# EAGLE design motorfilter (EAGLE 9.5.2)
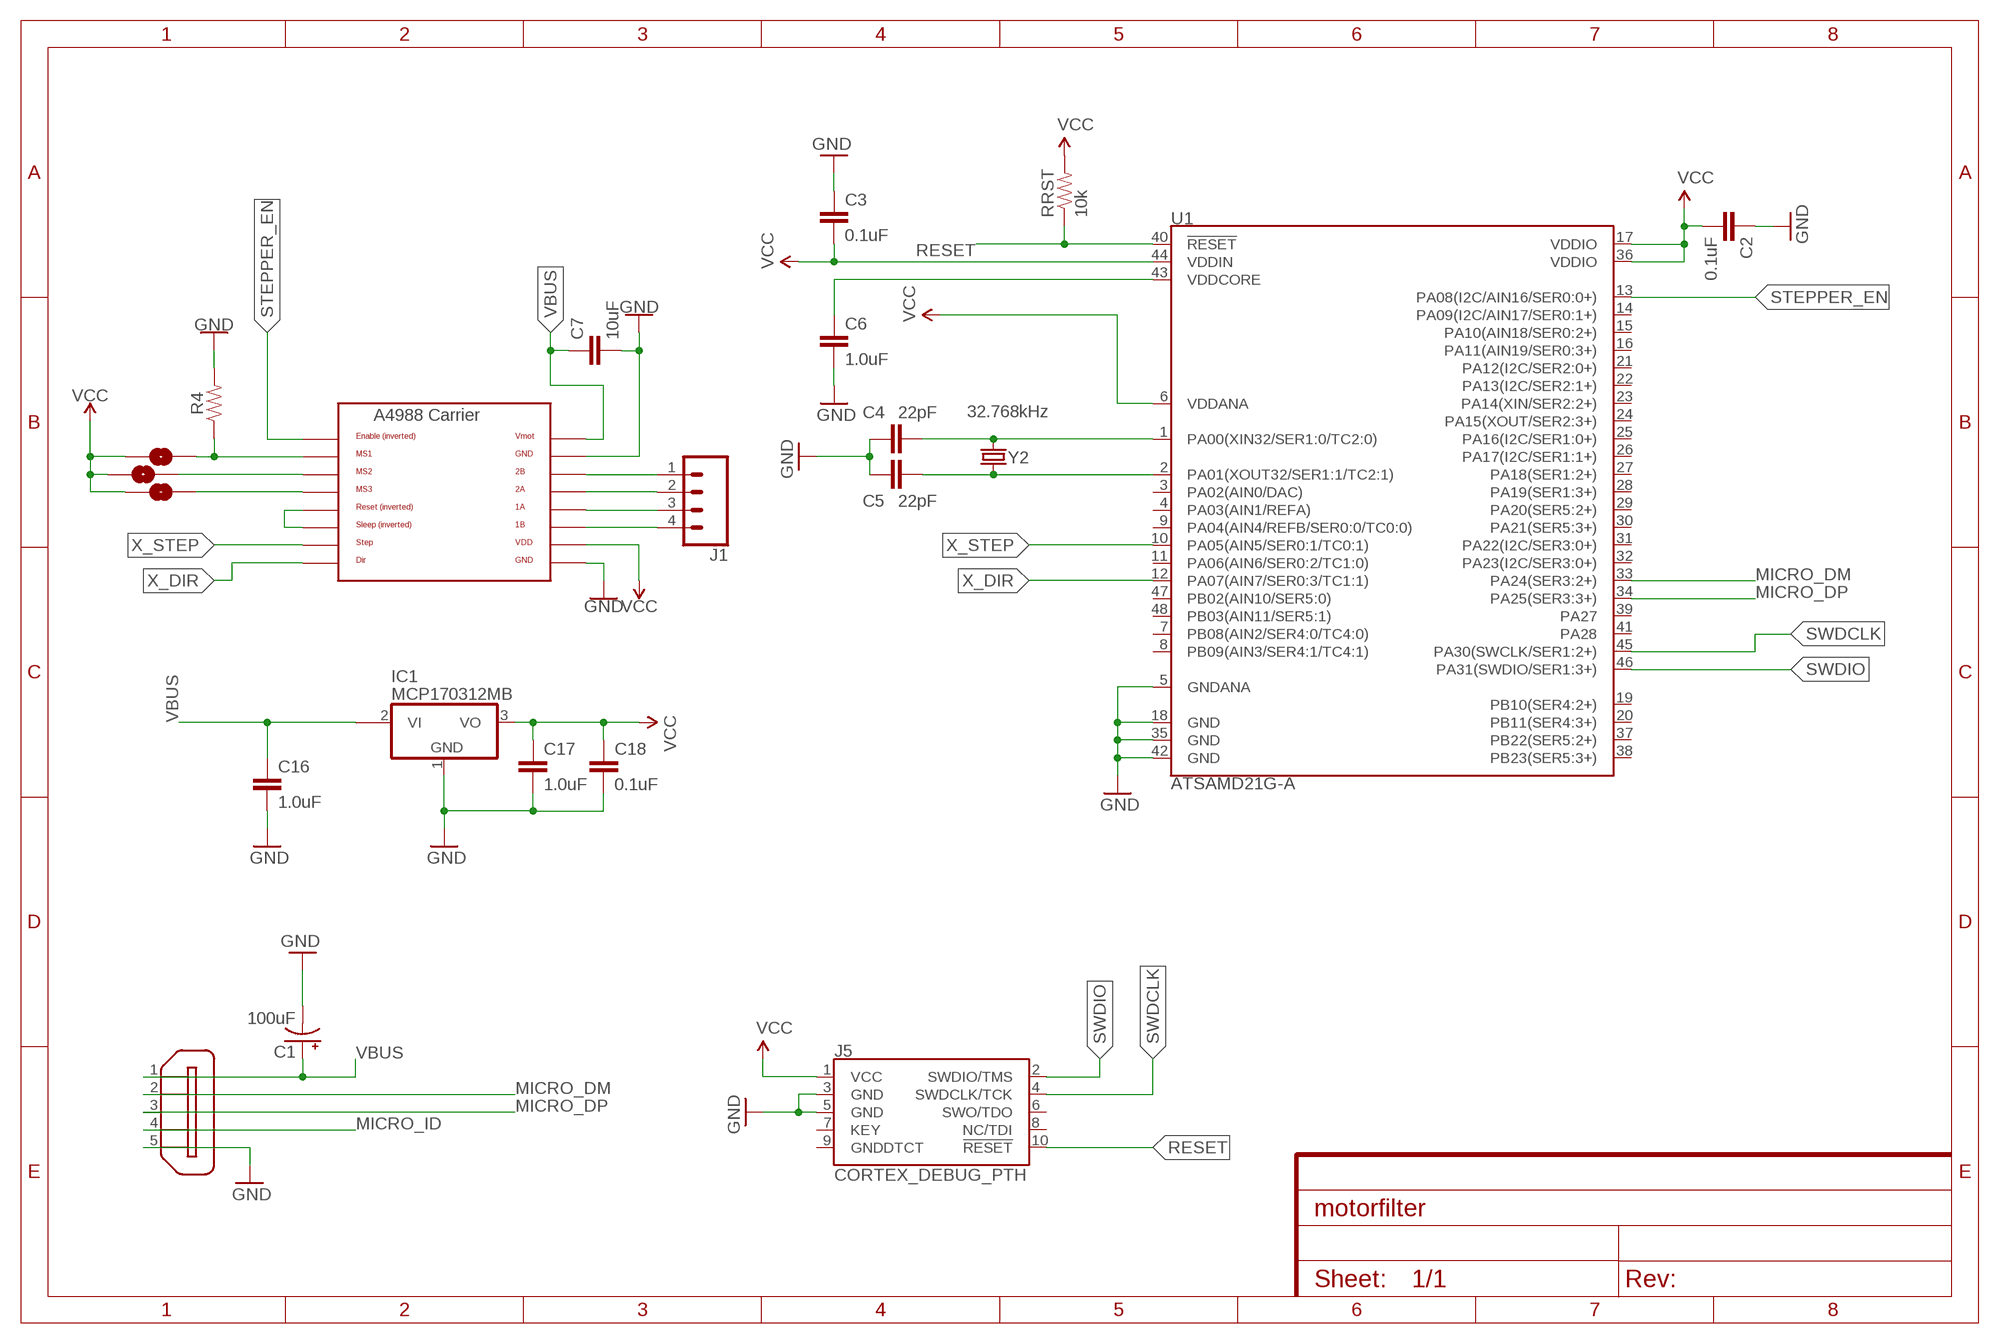
[diagram p0: schematic, sheet 1]

## Parts
C1  100uF  100UF-POLAR-25V-20%(ELEC)  [PANASONIC_D]
C2  0.1uF  1.0UF-0805-25V-10%  [0805]
C3  0.1uF  1.0UF-0805-25V-10%  [0805]
C4  22pF  CAP0805  [0805]
C5  22pF  CAP0805  [0805]
C6  1.0uF  1.0UF-0805-25V-10%  [0805]
C7  10uF  1.0UF-1206-50V-10%  [1206]
C16  1.0uF  1.0UF-0805-25V-10%  [0805]
C17  1.0uF  1.0UF-1206-50V-10%  [1206]
C18  0.1uF  1.0UF-0805-25V-10%  [0805]
IC1  MCP170312MB  [SOT89]
J1  CONN_04SCREW  [SCREWTERMINAL-3.5MM-4]
J5  CORTEX_DEBUG_PTH  [2X5-PTH-1.27MM]
JP4  JUMPER-SMT_2_NO_SILK_ROUND  [SMT-JUMPER_2_NO_SILK_ROUND]
JP5  JUMPER-SMT_2_NO_SILK_ROUND  [SMT-JUMPER_2_NO_SILK_ROUND]
JP6  JUMPER-SMT_2_NO_SILK_ROUND  [SMT-JUMPER_2_NO_SILK_ROUND]
R4  RESISTOR0805  [0805]
RRST  10k  RESISTOR0805-RES  [0805]
U1  ATSAMD21G-A  [TQFP-48]
U$2  A4988BREAKOUT  [A4988BREAKOUT]
X2  ZX62D-B-5PA8  [ZX62D-B-5PA8]
Y2  32.768kHz  CRYSTAL3.2X1.5MM  [CRYSTAL-SMD-3.2X1.5MM]

## Nets
GND: C1.- C2.1 C3.1 C4.1 C5.1 C6.2 C7.2 C16.2 C17.2 C18.2 IC1.1(GND) J5.3(GND) J5.5(GND) R4.2 U1.5(GNDANA) U1.18(GND) U1.35(GND) U1.42(GND) U$2.GND U$2.GND@0(GND) X2.5
MICRO_DM: U1.33(PA24(SER3:2+)) X2.2
MICRO_DP: U1.34(PA25(SER3:3+)) X2.3
MICRO_ID: X2.4
N$1: C6.1 U1.43(VDDCORE)
N$2: J1.1 U$2.2B
N$3: J1.2 U$2.2A
N$4: J1.3 U$2.1A
N$5: J1.4 U$2.1B
N$8: C4.2 U1.1(PA00(XIN32/SER1:0/TC2:0)) Y2.P$2
N$14: JP6.2 U$2.MS3
N$15: U$2.RST U$2.SLP(SLEEP)
N$16: JP4.2 R4.1 U$2.MS1
N$17: JP5.2 U$2.MS2
N$32: C5.2 U1.2(PA01(XOUT32/SER1:1/TC2:1)) Y2.P$1
RESET: J5.10(!RESET) RRST.1 U1.40(!RESET!)
STEPPER_EN: U1.13(PA08(I2C/AIN16/SER0:0+)) U$2.EN
SWDCLK: J5.4(SWDCLK/TCK) U1.45(PA30(SWCLK/SER1:2+))
SWDIO: J5.2(SWDIO/TMS) U1.46(PA31(SWDIO/SER1:3+))
VBUS: C1.+ C7.1 C16.1 IC1.2@1(VI1) U$2.VMOT X2.1
VCC [power]: C2.2 C3.2 C17.1 C18.1 IC1.3(VO) J5.1(VCC) JP4.1 JP5.1 JP6.1 RRST.2 U1.6(VDDANA) U1.17(VDDIO) U1.36(VDDIO) U1.44(VDDIN) U$2.VDD
X_DIR: U1.12(PA07(AIN7/SER0:3/TC1:1)) U$2.DIR
X_STEP: U1.10(PA05(AIN5/SER0:1/TC0:1)) U$2.STEP
Unconnected: IC1.2(VI) J5.6(SWO/TDO) J5.7(KEY) J5.8(NC/TDI) J5.9(GNDDTCT) U1.3(PA02(AIN0/DAC)) U1.4(PA03(AIN1/REFA)) U1.7(PB08(AIN2/SER4:0/TC4:0)) U1.8(PB09(AIN3/SER4:1/TC4:1)) U1.9(PA04(AIN4/REFB/SER0:0/TC0:0)) U1.11(PA06(AIN6/SER0:2/TC1:0)) U1.14(PA09(I2C/AIN17/SER0:1+)) U1.15(PA10(AIN18/SER0:2+)) U1.16(PA11(AIN19/SER0:3+)) U1.19(PB10(SER4:2+)) U1.20(PB11(SER4:3+)) U1.21(PA12(I2C/SER2:0+)) U1.22(PA13(I2C/SER2:1+)) U1.23(PA14(XIN/SER2:2+)) U1.24(PA15(XOUT/SER2:3+)) U1.25(PA16(I2C/SER1:0+)) U1.26(PA17(I2C/SER1:1+)) U1.27(PA18(SER1:2+)) U1.28(PA19(SER1:3+)) U1.29(PA20(SER5:2+)) U1.30(PA21(SER5:3+)) U1.31(PA22(I2C/SER3:0+)) U1.32(PA23(I2C/SER3:0+)) U1.37(PB22(SER5:2+)) U1.38(PB23(SER5:3+)) U1.39(PA27) U1.41(PA28) U1.47(PB02(AIN10/SER5:0)) U1.48(PB03(AIN11/SER5:1)) X2.S1 X2.S2 X2.S3 X2.S4

## Library data of the parts
C1 = SparkFun-Capacitors:100UF-POLAR: 100µF polarized capacitors A capacitor is a passive two-terminal electrical component used to store electrical energy temporarily in an electric field.; PROD_ID: CAP-12547
C2 C3 C18 = SparkFun-Capacitors:1.0UF: 1µF ceramic capacitors A capacitor is a passive two-terminal electrical component used to store electrical energy temporarily in an electric field.; PROD_ID: CAP-08064; VALUE: 1.0uF
C4 C5 = SparkFun-Passives:CAP: Capacitor Standard 0603 ceramic capacitor, and 0.1" leaded capacitor.
C6 C16 = SparkFun-Capacitors:1.0UF: 1µF ceramic capacitors A capacitor is a passive two-terminal electrical component used to store electrical energy temporarily in an electric field.; PROD_ID: CAP-08064
C7 = SparkFun-Capacitors:1.0UF: 1µF ceramic capacitors A capacitor is a passive two-terminal electrical component used to store electrical energy temporarily in an electric field.; PROD_ID: CAP-09822; VALUE: 1.0uF
C17 = SparkFun-Capacitors:1.0UF: 1µF ceramic capacitors A capacitor is a passive two-terminal electrical component used to store electrical energy temporarily in an electric field.; PROD_ID: CAP-09822
IC1 = linear:MCP1703*: 250 mA, 16V, Low Quiescent Current LDO Regulator Source: http://ww1.microchip.com/downloads/en/DeviceDoc/22049b.pdf
J1 = SparkFun-Connectors:CONN_04: Multi connection point. Often used as Generic Header-pin footprint for 0.1 inch spaced/style header connections On any of the 0.1 inch spaced packages, you can populate with these: Break Away Headers - Straight <https://www.sparkfun.com/products/116> (PRT-00116) Break Away Male Headers - Right Angle <https://www.sparkfun.com/products/553> (PRT-00553) Female Headers <https://www.sparkfun.com/products/115> (PRT-00115) Break Away Headers - Machine Pin <https://www.sparkfun.com/products/117> (PRT-00117) Break Away Female Headers - Swiss Machine Pin <https://www.sparkfun.com/products/743> (PRT-00743) For SCREWTERMINALS and SPRING TERMINALS visit here: Screw Terimnals on SparkFun.com <https://www.sparkfun.com/search/results?term=Screw+Terminals> (5mm/3.5mm/2.54mm spacing) This device is also useful as a general connection point to wire up your design to another part of your project. Our various solder wires solder well into these plated through hole pads. Hook-Up Wire - Assortment (Stranded, 22 AWG) <https://www.sparkfun.com/products/11375> (PRT-11375) Hook-Up Wire - Assortment (Solid Core, 22 AWG) <https://www.sparkfun.com/products/11367> (PRT-11367) View the entire wire category on our website here <https://www.sparkfun.com/categories/141> Special notes: Molex polarized connector foot print use with SKU : PRT-08231 with associated crimp pins and housings. 1MM SMD Version SKU: PRT-10208; PROD_ID: 2xCONN-08399; SF_ID: 2xPRT-08084
J5 = SparkFun-Connectors:CORTEX_DEBUG: Cortex Debug Connector - 10 pin Supports JTAG debug, Serial Wire debug, and Serial Wire Viewer. PTH and SMD connector options available. General Connector Information <http://infocenter.arm.com/help/topic/com.arm.doc.faqs/attached/13634/cortex_debug_connectors.pdf> Products: PTH Connector <http://www.digikey.com/product-detail/en/cnc-tech/3220-10-0100-00/1175-1627-ND/3883661> -via Digi-Key SparkFun PSoc <https://www.sparkfun.com/products/13229> SparkFun T <https://www.sparkfun.com/products/13810>
JP4-JP6 = SparkFun-Jumpers:JUMPER-SMT_2_NO: Normally open jumper This jumper has two pads in close proximity to each other. Apply solder to close the connection. Round pads are easier to solder for beginners, but are a lot larger. SparkFun Product that uses the round pads: SparkFun EL Sequencer <https://www.sparkfun.com/products/12781>
R4 = SparkFun-Resistors:RESISTOR: Generic Resistor Package
RRST = SparkFun-Passives:RESISTOR: Resistor Basic schematic elements and footprints for 0603, 1206, and PTH resistors.
U1 = SparkFun-IC-Microcontroller:ATSAMD21G: Atmel SAMD21G SMART ARM-Based Microcontroller The Atmel ® | SMART ™ SAM D21 is a series of low-power microcontrollers using the 32-bit ARM ® Cortex ® -M0+ processor, and ranging from 32- to 64-pins with up to 256KB Flash and 32KB of SRAM. The SAM D21 devices operate at a maximum frequency of 48MHz and reach 2.46 CoreMark/MHz. They are designed for simple and intuitive migration with identical peripheral modules, hex compatible code, identical linear address map and pin compatible migration paths between all devices in the product series. All devices include intelligent and flexible peripherals, Atmel Event System for inter-peripheral signaling, and support for capacitive touch button, slider and wheel user interfaces. Datasheet <https://cdn.sparkfun.com/datasheets/Dev/Arduino/Boards/Atmel-42181-SAM-D21_Datasheet.pdf> SparkFun Products SparkFun SAMD21 Mini Breakout <https://www.sparkfun.com/products/13664> (DEV-13664) SparkFun SAMD21 Dev Breakout <https://www.sparkfun.com/products/13672> (DEV-13672); PROD_ID: IC-13064
U$2 = RepRapjr:A4988BREAKOUT
X2 = zx62d-b-5pa8-oshpark_10:ZX62D-B-5PA8: Micro USB Type B Connector - Standard, Shell Through Hole Source: http://www.hirose.co.jp/cataloge_hp/ed_ZX_20140804.pdf; MF: Hirose; MPN: ZX62D-B-5PA8; OC_FARNELL: 2300438; OC_NEWARK: 69W0712
Y2 = samd21-temp:CRYSTAL: Various standard crystals. Proven footprints.; PROD_ID: XTAL-13062

## Net classes
1 power: width 0.254 mm, clearance 0.203 mm
4 highpower: clearance 0.305 mm

## Board
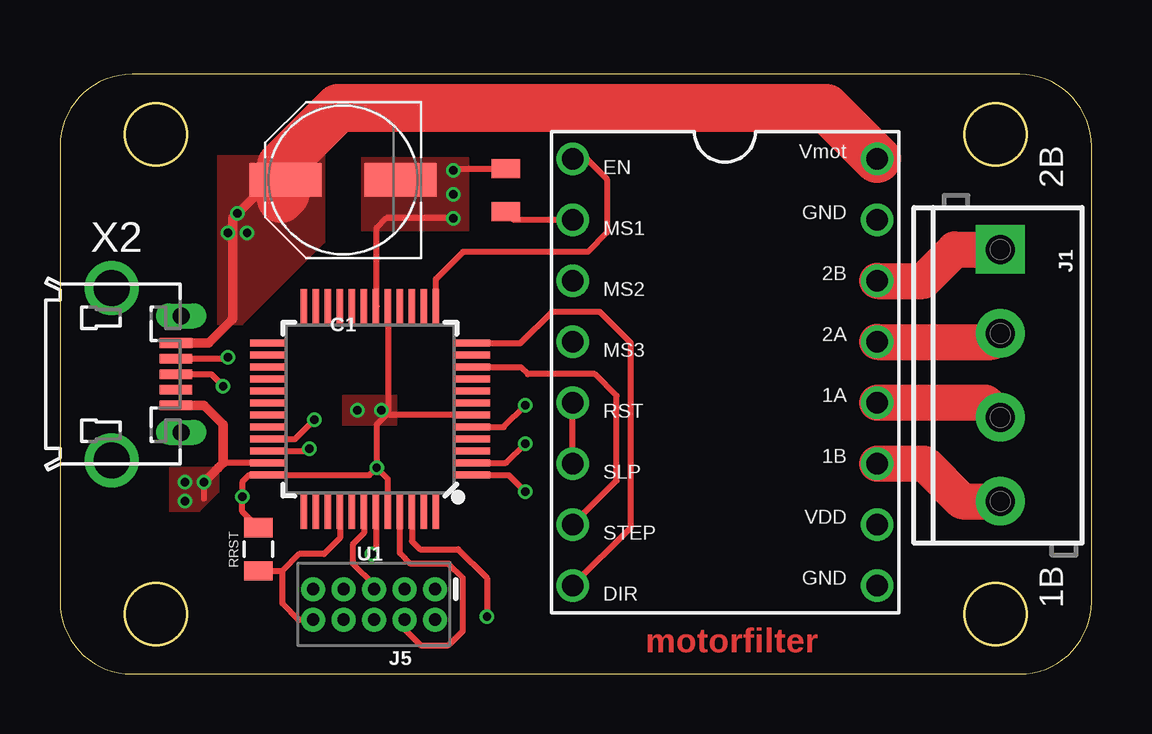
[diagram p1: board, top side]
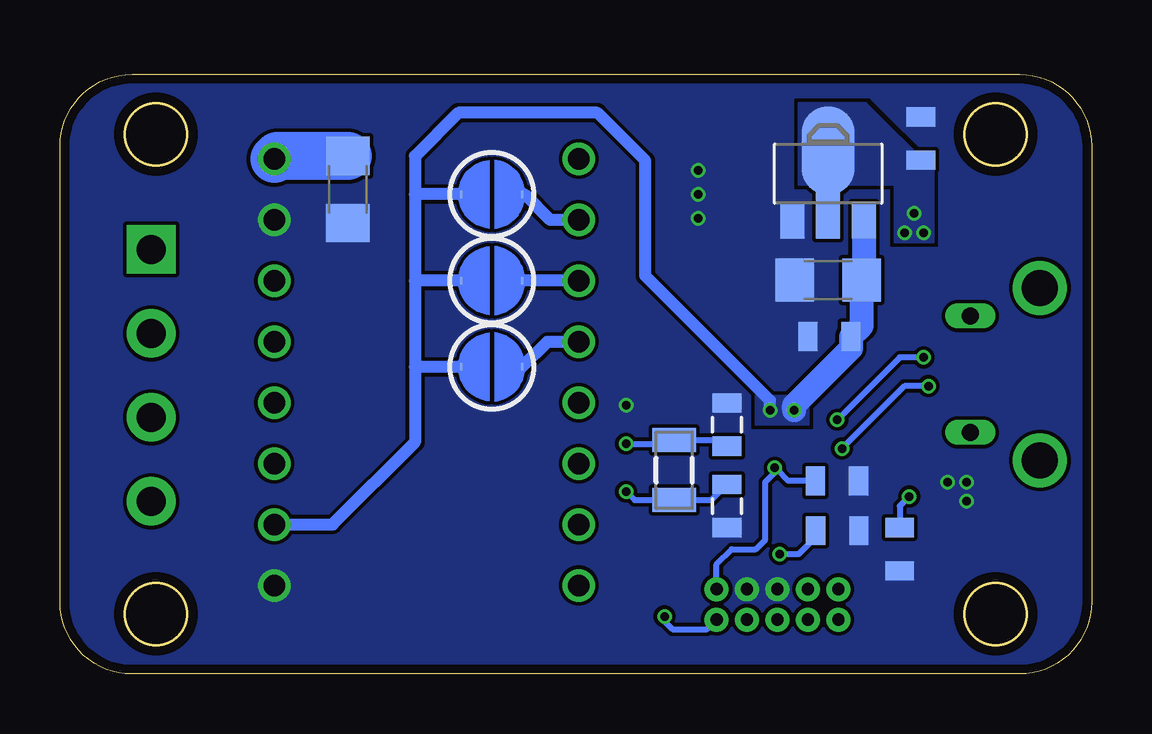
[diagram p2: board, bottom side, seen from below]

Size 43 x 25 mm. Coordinates in mm from the lower left corner, seen from the top.
Outline: 0,22 0,3 arc90 3,0 40,0 arc90 43,3 43,22 arc90 40,25 3,25 arc90 0,22
Outline: circle at 4,2.5 radius 1.3
Outline: circle at 39,2.5 radius 1.3
Outline: circle at 4,22.5 radius 1.3
Outline: circle at 39,22.5 radius 1.3
Copper layers (1*16): Top 0.035559375mm / dielectric 1.6mm / Bottom 0.035559375mm
Design rules "oshpark-2layer": minimum track width 6mil, minimum drill 10mil, track to track 6mil, track to pad 6mil, pad to pad 6mil, via to via 6mil, smd to smd 6mil, copper to edge 15mil, drill to drill 6mil, minimum pad ring 5mil, minimum via ring 5mil, stop-mask expansion 2.5mil, vias tented up to drill 0mil, thermal gap 10mil

### Footprints (pad centres in the part's own frame; a part is rotated, then mirrored left to right if it is on the bottom)
PANASONIC_D = smd 3 x 1.4: + 2.4,0; - -2.4,0
0805 = smd 0.8 x 1.2: 1 -0.9,0; 2 0.9,0
1206 = smd 1.6 x 1.8: 1 -1.4,0; 2 1.4,0
SOT89 = smd 1 x 1.5: 1 -1.499,-1.981; 3 1.499,-1.981 | smd 1 x 2: 2 0,-1.727 | smd 2.2 x 3.7: 2@1 0,0.94
SCREWTERMINAL-3.5MM-4 = drill 1.2 pad 2.032 square: 1 0,0 | drill 1.2 pad 2.032: 2 3.5,0; 3 7,0; 4 10.5,0
2X5-PTH-1.27MM = drill 0.508 pad 1: 1 -2.54,-0.635; 2 -2.54,0.635; 3 -1.27,-0.635; 4 -1.27,0.635; 5 0,-0.635; 6 0,0.635; 7 1.27,-0.635; 8 1.27,0.635; 9 2.54,-0.635; 10 2.54,0.635
SMT-JUMPER_2_NO_SILK_ROUND = smd 0.152 x 0.305: 1 -1.27,0; 2 1.27,0
TQFP-48 = smd 1.5 x 0.28: 1 -4.25,2.75; 2 -4.25,2.25; 3 -4.25,1.75; 4 -4.25,1.25; 5 -4.25,0.75; 6 -4.25,0.25; 7 -4.25,-0.25; 8 -4.25,-0.75; 9 -4.25,-1.25; 10 -4.25,-1.75; 11 -4.25,-2.25; 12 -4.25,-2.75; 25 4.25,-2.75; 26 4.25,-2.25; 27 4.25,-1.75; 28 4.25,-1.25; 29 4.25,-0.75; 30 4.25,-0.25; 31 4.25,0.25; 32 4.25,0.75; 33 4.25,1.25; 34 4.25,1.75; 35 4.25,2.25; 36 4.25,2.75 | smd 0.28 x 1.5: 13 -2.75,-4.25; 14 -2.25,-4.25; 15 -1.75,-4.25; 16 -1.25,-4.25; 17 -0.75,-4.25; 18 -0.25,-4.25; 19 0.25,-4.25; 20 0.75,-4.25; 21 1.25,-4.25; 22 1.75,-4.25; 23 2.25,-4.25; 24 2.75,-4.25; 37 2.75,4.25; 38 2.25,4.25; 39 1.75,4.25; 40 1.25,4.25; 41 0.75,4.25; 42 0.25,4.25; 43 -0.25,4.25; 44 -0.75,4.25; 45 -1.25,4.25; 46 -1.75,4.25; 47 -2.25,4.25; 48 -2.75,4.25
A4988BREAKOUT = drill 0.9: 1A 8.89,1.27; 1B 11.43,1.27; 2A 6.35,1.27; 2B 3.81,1.27; DIR 16.51,-11.43; EN -1.27,-11.43; GND 16.51,1.27; GND@0 1.27,1.27; MS1 1.27,-11.43; MS2 3.81,-11.43; MS3 6.35,-11.43; RST 8.89,-11.43; SLP 11.43,-11.43; STEP 13.97,-11.43; VDD 13.97,1.27; VMOT -1.27,1.27
ZX62D-B-5PA8 = smd 1.35 x 0.4: 1 4.825,1.3; 2 4.825,0.65; 3 4.825,0; 4 4.825,-0.65; 5 4.825,-1.3 | drill 1.5: S1 2.15,-3.6; S2 2.15,3.6 | drill 0.7 long: S3 5.05,2.425; S4 5.05,-2.425
CRYSTAL-SMD-3.2X1.5MM = smd 1 x 1.8: P$1 -1.25,0; P$2 1.25,0

### Placement (x,y rotation side)
C1  11.8,20.6 180 top
C2  8,5.2 90 bottom
C3  10.6,8.05 180 bottom
C4  15.2,7 90 bottom
C5  15.2,10.4 270 bottom
C6  10.6,5.97 0 bottom
C7  31,20.2 270 bottom
C16  7.12,22.32 90 bottom
C17  10.98,16.42 180 bottom
C18  10.93,14.07 180 bottom
IC1  10.98,20.87 0 bottom
J1  39.2,17.7 270 top
J5  13.09,2.9 180 top
JP4  25,20 0 bottom
JP5  25,16.4 0 bottom
JP6  25,12.8 0 bottom
R4  18.58,20.17 90 top
RRST  8.27,5.2 90 top
U1  12.92,11.04 180 top
U$2  32.8,20.2 270 top
X2  0,12.5 0 top
Y2  17.4,8.5 270 bottom

### Tracks (layer width: path | path; a pad name or v marks a point on that pad's centre or on a via)
GND  (via drill 0.35)
  Top 0.254: U1.5 18.49,10.29 v19.4,11.2 | v16.4,21 16.47,21.07 R4.2 | U1.18 13.2,15.32 13.2,18.6 13.6,19 v16.4,19 | U1.42 12.67,5.87 12.2,5.4 12.2,4.6 13.09,3.71 J5.5 | U1.35 6.79,8.79 6.6,8.6 | 6,7.3 v6,8
  Top 0.4: X2.5 6,11.2 6.8,10.4 6.8,8.8 6.6,8.6 v6,8
  other vias: 5.2,7.2 16.4,20 5.2,8
  pour Bottom (rank 2, no thermals): 0,0 43,0 43,25 0,25
  pour Top (no thermals): 17,21.5 12.6,21.5 12.6,18.5 17,18.5
  pour Top: 6.6,8.6 4.6,8.6 4.6,6.8 5.8,6.8 6.6,7.6
MICRO_DM  (via drill 0.35)
  Top 0.254: U1.33 9.79,9.79 v10.6,10.6 | X2.2 6.95,13.15 v7,13.2
  Bottom 0.254: v10.6,10.6 8,13.2 v7,13.2
MICRO_DP  (via drill 0.35)
  Top 0.254: U1.34 10.29,9.29 v10.4,9.4 | X2.3 6.3,12.5 v6.8,12
  Bottom 0.254: v10.4,9.4 7.8,12 v6.8,12
N$1  (via drill 0.35)
  Top 0.254: U1.43 13.17,5.19 13,5.02 v13,5
  Bottom 0.254: v13,5 12.2,5 11.5,5.7 C6.1
N$2
  Top 1.5: U$2.2B 35.99,16.39 37.3,17.7 J1.1
N$3
  Top 1.5: U$2.2A 38.85,13.85 J1.2
N$4
  Top 1.5: U$2.1A 38.59,11.31 J1.3
N$5
  Top 1.5: U$2.1B 36.03,8.77 37.6,7.2 J1.4
N$8  (via drill 0.35)
  Top 0.254: U1.1 18.71,8.29 v19.4,7.6
  Bottom 0.254: v19.4,7.6 19.05,7.25 Y2.P$2 15.85,7.25 C4.2
N$14
  Bottom 0.508: JP6.2 22.68,13.85 U$2.MS3
N$15
  Top 0.254: U$2.SLP U$2.RST
N$16
  Top 0.254: U$2.MS1 18.93,18.93 R4.1
  Bottom 0.508: U$2.MS1 22.57,18.93 23.64,20 JP4.2
N$17
  Bottom 0.508: U$2.MS2 JP5.2
N$32  (via drill 0.35)
  Top 0.254: U1.2 18.6,8.8 v19.4,9.6
  Bottom 0.254: v19.4,9.6 17.55,9.6 Y2.P$1 15.45,9.75 C5.2
RESET
  Top 0.254: U1.40 11.67,5.67 11,5 9.97,5 9.27,4.3 | RRST.1 9.27,4.3 | J5.10 9.93,2.27 9.27,2.93 9.27,4.3
STEPPER_EN
  Top 0.254: U$2.EN 21.97,21.47 22.8,20.64 22.8,18.4 22,17.6 16.8,17.6 15.67,16.47 U1.13
SWDCLK
  Top 0.254: J5.4 14.36,1.87 15.03,1.2 16.2,1.2 16.8,1.8 16.8,4 16.2,4.6 14.6,4.6 14.17,5.03 U1.45
SWDIO  (via drill 0.35)
  Top 0.254: v17.8,2.4 17.8,4 16.6,5.2 15,5.2 14.67,5.53 U1.46
  Bottom 0.254: v17.8,2.4 17.8,2.2 17.47,1.87 16.03,1.87 J5.2
VBUS  (via drill 0.35)
  Top 0.4: X2.1 6.2,13.8 7.2,14.8 7.2,19 | v7.4,19.2 8.8,20.6 C1.+
  Top 2: U$2.VMOT 31.94,23.6 11.6,23.6 9.2,21.2 9.2,19.8 9.4,20 C1.+
  Bottom 2: C7.1 33.94,21.6 U$2.VMOT
  other vias: 7,18.4 7.8,18.4
  pour Top (no thermals): 11,21.6 6.6,21.6 6.6,14.6 7.6,14.6 11,18
  pour Bottom (no thermals): 12.2,23.8 9.4,23.8 6.6,21 6.6,18 8.2,18 8.2,20.4 12.2,20.4
VCC  (via drill 0.35)
  Top 0.254: U1.44 13.67,8.13 v13.2,8.6 | v13.2,8.6 12.89,8.29 U1.36 7.89,8.29 7.6,8 v7.6,7.4 7.6,6.77 RRST.2 | U1.6 13.59,10.79 | 13.59,10.79 13.2,10.4 v13.2,8.6 | U1.17 13.67,10.87 13.59,10.79
  Bottom 0.254: C3.2 12.65,8.05 13.1,8.5 | 13.1,8.5 v13.2,8.6 | J5.1 15.63,4.57 15,5.2 14,5.2 13.6,5.6 13.6,8 13.1,8.5 | v7.6,7.4 8,7 C2.2
  Bottom 0.508: U$2.VDD 31.63,6.23 28.2,9.66 28.2,12.8 | v13.4,11 13.4,11.4 18.6,16.6 18.6,21.4 20.6,23.4 26.4,23.4 28.2,21.6 28.2,20 | 28.2,20 28.2,16.4 | 28.2,16.4 28.2,12.8 | JP4.1 28.2,20 | JP5.1 28.2,16.4 | JP6.1 28.2,12.8
  Bottom 1: IC1.3 9.48,16.52 C17.1 9.58,14.51 C18.1 10.03,13.57 12.4,11.2 v12.4,11
  pour Bottom: 14,11.6 11.8,11.6 11.8,10.4 14,10.4
  pour Top: 11.8,11.6 11.8,10.4 14,10.4 14,11.6
X_DIR
  Top 0.254: U$2.DIR 23.8,6.12 23.8,13.8 22.5,15.1 20.5,15.1 19.19,13.79 U1.12
X_STEP
  Top 0.254: U$2.STEP 23.2,8.06 23.2,11.6 22.3,12.5 19.5,12.5 19.21,12.79 U1.10

### Text on the board
Top: motorfilter
tPlace: 2B | 1B
tStop: motorfilter